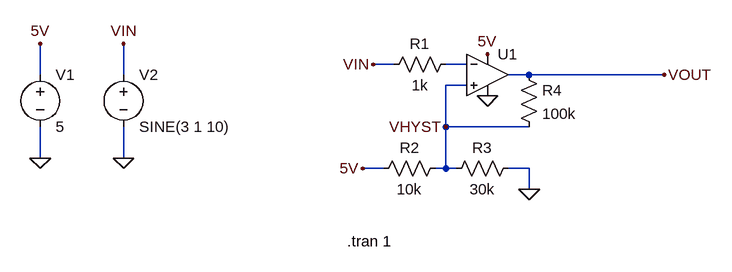
[diagram p0: schematic low_battery_indicator.asc]
low_battery_indicator.asc, the LTspice schematic file:
Version 4
SHEET 1 880 680
WIRE 48 112 16 112
WIRE 160 112 128 112
WIRE -496 128 -496 80
WIRE -368 128 -368 80
WIRE 256 128 224 128
WIRE 464 128 256 128
WIRE 160 144 128 144
WIRE 128 208 128 144
WIRE 256 208 128 208
WIRE -496 256 -496 208
WIRE -368 256 -368 208
WIRE 32 272 0 272
WIRE 128 272 128 208
WIRE 128 272 112 272
WIRE 144 272 128 272
WIRE 256 272 224 272
WIRE 256 304 256 272
FLAG -496 256 0
FLAG -368 256 0
FLAG -496 80 5V
FLAG -368 80 VIN
FLAG 192 96 5V
FLAG 16 112 VIN
FLAG 192 160 0
FLAG 0 272 5V
FLAG 256 304 0
FLAG 464 128 VOUT
FLAG 128 208 VHYST
SYMBOL OpAmps\\UniversalOpAmp2 192 128 R0
SYMATTR InstName U1
SYMBOL voltage -496 112 R0
WINDOW 123 0 0 Left 0
WINDOW 39 0 0 Left 0
SYMATTR InstName V1
SYMATTR Value 5
SYMBOL voltage -368 112 R0
WINDOW 123 0 0 Left 0
WINDOW 39 0 0 Left 0
SYMATTR InstName V2
SYMATTR Value SINE(3 1 10)
SYMBOL res 144 96 R90
WINDOW 0 0 56 VBottom 2
WINDOW 3 32 56 VTop 2
SYMATTR InstName R1
SYMATTR Value 1k
SYMBOL res 128 256 R90
WINDOW 0 0 56 VBottom 2
WINDOW 3 32 56 VTop 2
SYMATTR InstName R2
SYMATTR Value 10k
SYMBOL res 240 256 R90
WINDOW 0 0 56 VBottom 2
WINDOW 3 32 56 VTop 2
SYMATTR InstName R3
SYMATTR Value 30k
SYMBOL res 240 112 R0
SYMATTR InstName R4
SYMATTR Value 100k
TEXT -24 384 Left 2 !.tran 1

The netlist it stands for:
* low_battery_indicator.asc
XU1 VHYST N001 5V 0 VOUT level2 Avol=1Meg GBW=10Meg Slew=10Meg Ilimit=25m Rail=0 Vos=0 En=0 Enk=0 In=0 Ink=0 Rin=500Meg  ; pins In+ In- V+ V- OUT
V1 5V 0 5
V2 VIN 0 SINE(3 1 10)
R1 N001 VIN 1k
R2 VHYST 5V 10k
R3 0 VHYST 30k
R4 VOUT VHYST 100k
.tran 1
.lib UniversalOpAmp2.lib
.backanno
.end